# Altium schematic sheet ControllerDiagrams.SchDoc
size 1016 x 254 mm; SheetNumber: 1; SheetTotal: 1
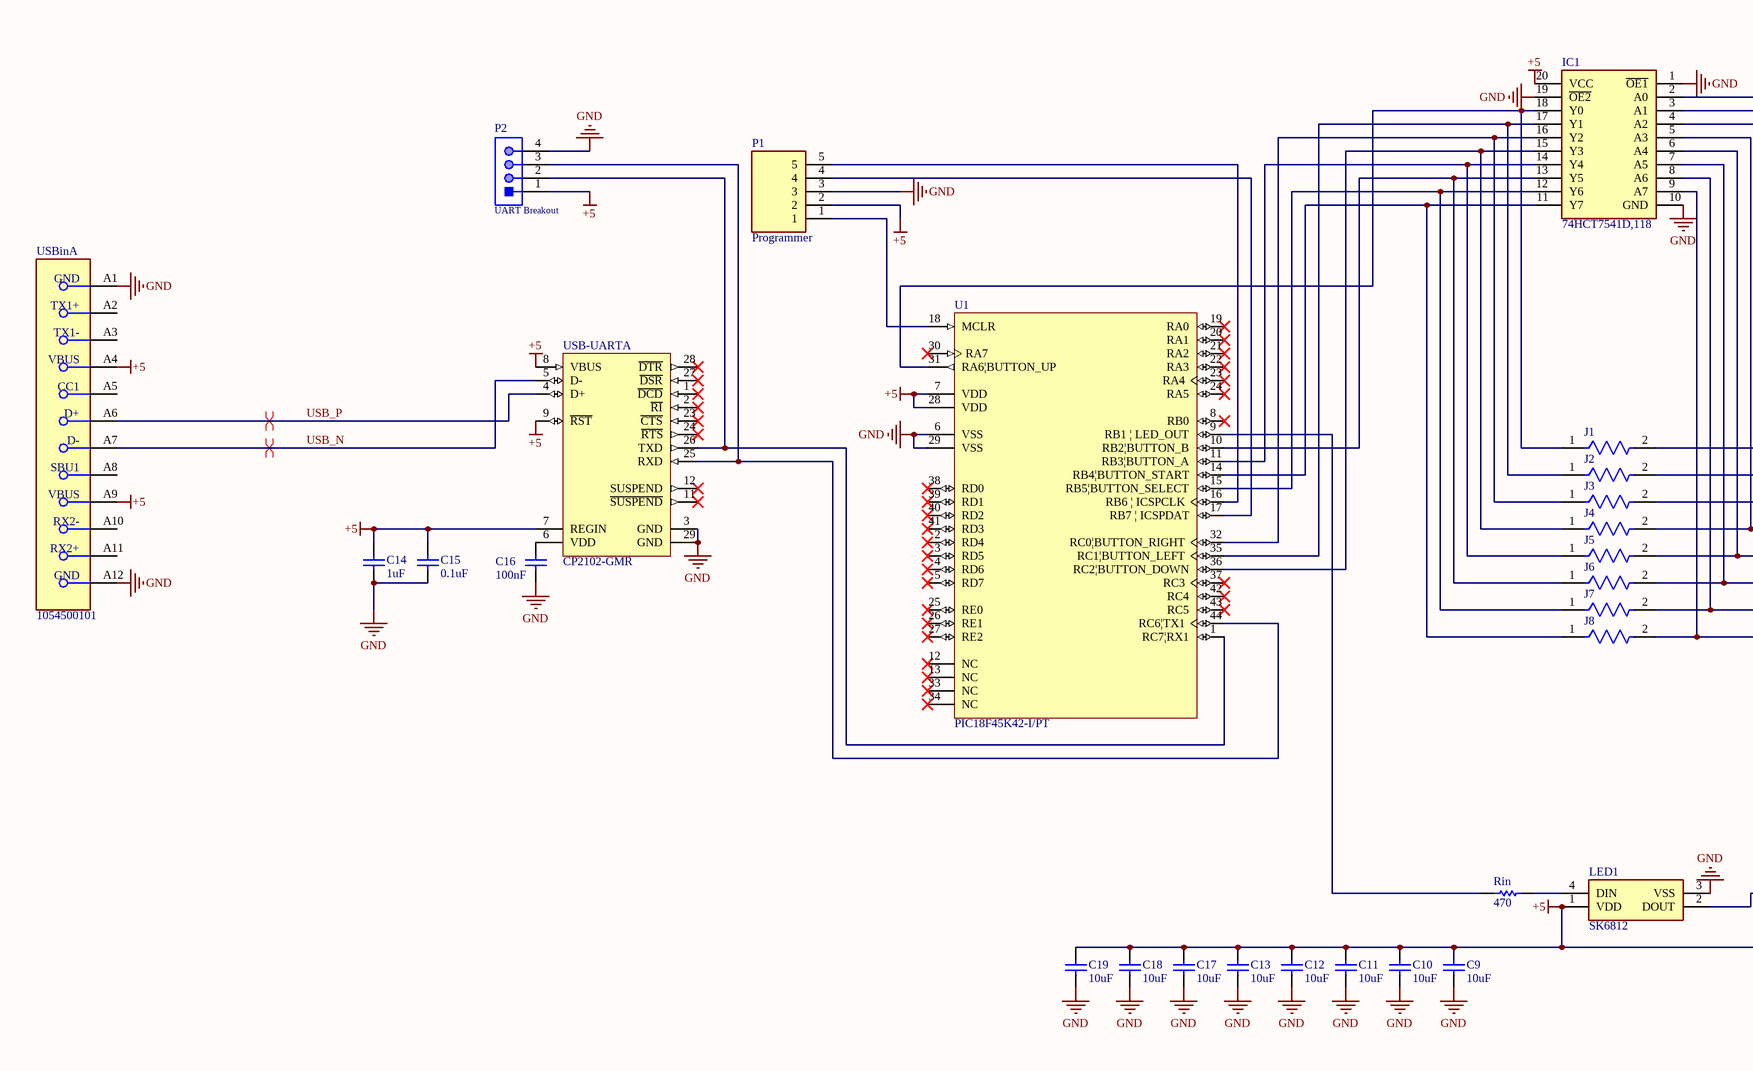
[diagram p0: ControllerDiagrams.SchDoc, left]
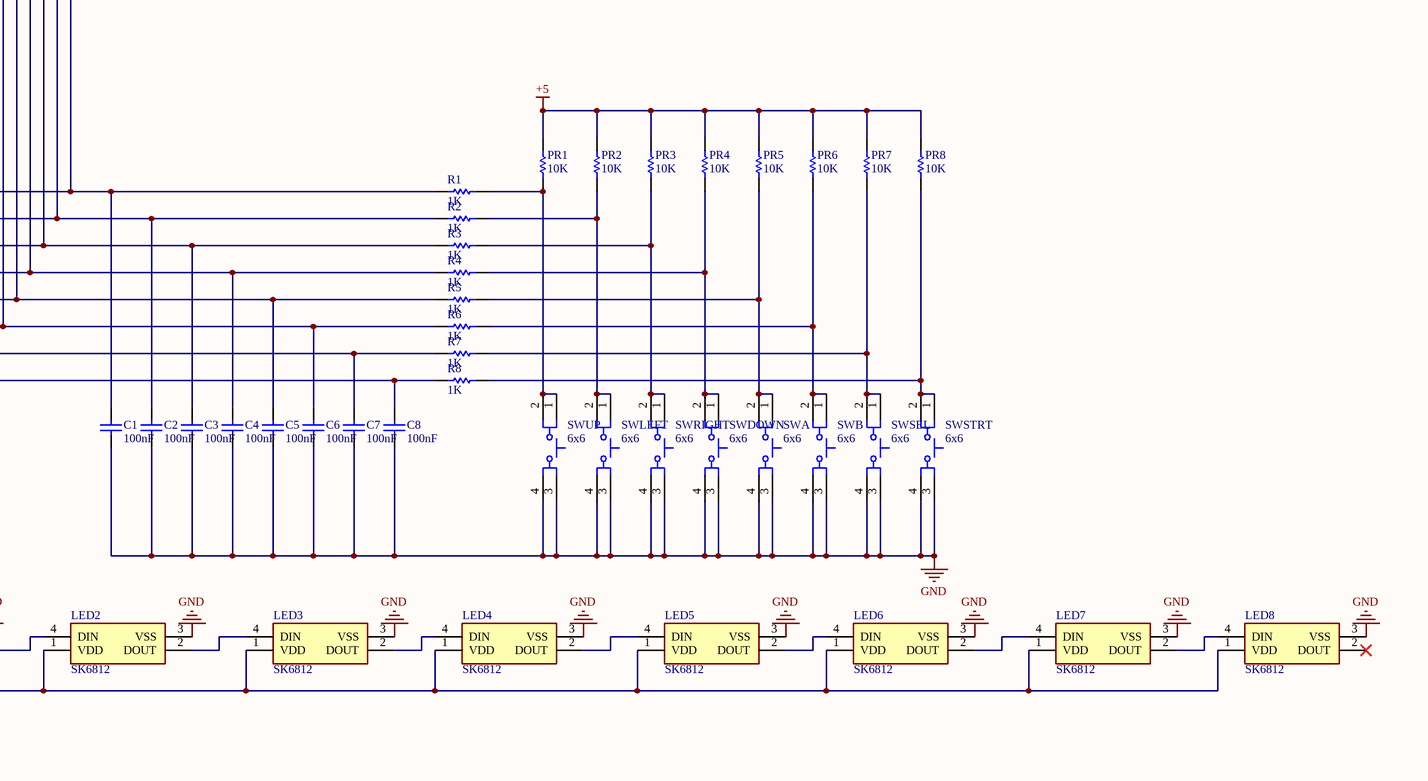
[diagram p1: ControllerDiagrams.SchDoc, right]

## Parts
C1  100nF  [CAPC2013X140X50LL20T25]
C2  100nF  [CAPC2013X140X50LL20T25]
C3  100nF  [CAPC2013X140X50LL20T25]
C4  100nF  [CAPC2013X140X50LL20T25]
C5  100nF  [CAPC2013X140X50LL20T25]
C6  100nF  [CAPC2013X140X50LL20T25]
C7  100nF  [CAPC2013X140X50LL20T25]
C8  100nF  [CAPC2013X140X50LL20T25]
C9  10uF  [CAPC2013X140X50LL20T25]
C10  10uF  [CAPC2013X140X50LL20T25]
C11  10uF  [CAPC2013X140X50LL20T25]
C12  10uF  [CAPC2013X140X50LL20T25]
C13  10uF  [CAPC2013X140X50LL20T25]
C14  1uF  [CAPC2013X140X50LL20T25]
C15  0.1uF  [CAPC2013X140X50LL20T25]
C16  100nF  [CAPC2013X140X50LL20T25]
C17  10uF  [CAPC2013X140X50LL20T25]
C18  10uF  [CAPC2013X140X50LL20T25]
C19  10uF  [CAPC2013X140X50LL20T25]
IC1  74HCT7541D,118  [SOIC127P1032X265-20N]
J1  (no value)  [FP-ERJ-3GEY0R00V-MFG]
J2  (no value)  [FP-ERJ-3GEY0R00V-MFG]
J3  (no value)  [FP-ERJ-3GEY0R00V-MFG]
J4  (no value)  [FP-ERJ-3GEY0R00V-MFG]
J5  (no value)  [FP-ERJ-3GEY0R00V-MFG]
J6  (no value)  [FP-ERJ-3GEY0R00V-MFG]
J7  (no value)  [FP-ERJ-3GEY0R00V-MFG]
J8  (no value)  [FP-ERJ-3GEY0R00V-MFG]
LED1  SK6812  [ILPHK501RGBWSK68120501]
LED2  SK6812  [ILPHK501RGBWSK68120501]
LED3  SK6812  [ILPHK501RGBWSK68120501]
LED4  SK6812  [ILPHK501RGBWSK68120501]
LED5  SK6812  [ILPHK501RGBWSK68120501]
LED6  SK6812  [ILPHK501RGBWSK68120501]
LED7  SK6812  [ILPHK501RGBWSK68120501]
LED8  SK6812  [ILPHK501RGBWSK68120501]
P1  Programmer  [HDRV5W64P0X254_1X5_1270X248X838P]
P2  UART Breakout  [61300411121]
PR1  10K  [RESC2013X50X30LL20T20]
PR2  10K  [RESC2013X50X30LL20T20]
PR3  10K  [RESC2013X50X30LL20T20]
PR4  10K  [RESC2013X50X30LL20T20]
PR5  10K  [RESC2013X50X30LL20T20]
PR6  10K  [RESC2013X50X30LL20T20]
PR7  10K  [RESC2013X50X30LL20T20]
PR8  10K  [RESC2013X50X30LL20T20]
R1  1K  [RESC2013X50X30LL20T20]
R2  1K  [RESC2013X50X30LL20T20]
R3  1K  [RESC2013X50X30LL20T20]
R4  1K  [RESC2013X50X30LL20T20]
R5  1K  [RESC2013X50X30LL20T20]
R6  1K  [RESC2013X50X30LL20T20]
R7  1K  [RESC2013X50X30LL20T20]
R8  1K  [RESC2013X50X30LL20T20]
Rin  470  [RESC2013X50X30LL20T20]
SWA  6x6  [ESWI-TL1105SPF_V]
SWB  6x6  [ESWI-TL1105SPF_V]
SWDOWN  6x6  [ESWI-TL1105SPF_V]
SWLEFT  6x6  [ESWI-TL1105SPF_V]
SWRIGHT  6x6  [ESWI-TL1105SPF_V]
SWSEL  6x6  [ESWI-TL1105SPF_V]
SWSTRT  6x6  [ESWI-TL1105SPF_V]
SWUP  6x6  [ESWI-TL1105SPF_V]
U1  PIC18F45K42-I/PT  [TQFP-PT44_M]
USB-UART  CP2102-GMR  [SLAB-QFN-28-3125x3125TP_M]  (part A of 2)
USBin  1054500101  [FP-1054500101-MFG]  (part A of 3)

## Nets
+5: C9.2 C10.2 C11.2 C12.2 C13.2 C14.2 C15.2 C17.2 C18.2 C19.2 IC1.20(VCC) LED1.1(VDD) LED2.1(VDD) LED3.1(VDD) LED4.1(VDD) LED5.1(VDD) LED6.1(VDD) LED7.1(VDD) LED8.1(VDD) P1.2 P2.1 PR1.2 PR2.2 PR3.2 PR4.2 PR5.2 PR6.2 PR7.2 PR8.2 U1.7(VDD) U1.28(VDD) USB-UART.7(REGIN) USB-UART.8(VBUS) USB-UART.9(~{RST}) USBin.A4(VBUS) USBin.A9(VBUS)
GND: C1.1 C2.1 C3.1 C4.1 C5.1 C6.1 C7.1 C8.1 C9.1 C10.1 C11.1 C12.1 C13.1 C14.1 C15.1 C16.2 C17.1 C18.1 C19.1 IC1.1(~{OE1}) IC1.10(GND) IC1.19(~{OE2}) LED1.3(VSS) LED2.3(VSS) LED3.3(VSS) LED4.3(VSS) LED5.3(VSS) LED6.3(VSS) LED7.3(VSS) LED8.3(VSS) P1.3 P2.4 SWA.3 SWA.4 SWB.3 SWB.4 SWDOWN.3 SWDOWN.4 SWLEFT.3 SWLEFT.4 SWRIGHT.3 SWRIGHT.4 SWSEL.3 SWSEL.4 SWSTRT.3 SWSTRT.4 SWUP.3 SWUP.4 U1.6(VSS) U1.29(VSS) USB-UART.3(GND) USB-UART.29(GND) USBin.A1(GND) USBin.A12(GND)
USB_N: USB-UART.5(D-) USBin.A7(D-)
USB_P: USB-UART.4(D+) USBin.A6(D+)
NetC1_2: C1.2 IC1.2(A0) J1.2 R1.2
NetC2_2: C2.2 IC1.3(A1) J2.2 R2.2
NetC3_2: C3.2 IC1.4(A2) J3.2 R3.2
NetC4_2: C4.2 IC1.5(A3) J4.2 R4.2
NetC5_2: C5.2 IC1.6(A4) J5.2 R5.2
NetC6_2: C6.2 IC1.7(A5) J6.2 R6.2
NetC7_2: C7.2 IC1.8(A6) J7.2 R7.2
NetC8_2: C8.2 IC1.9(A7) J8.2 R8.2
NetC16_1: C16.1 USB-UART.6(VDD)
NetIC1_11: IC1.11(Y7) J8.1 U1.14(RB4|BUTTON_START)
NetIC1_12: IC1.12(Y6) J7.1 U1.15(RB5|BUTTON_SELECT)
NetIC1_13: IC1.13(Y5) J6.1 U1.10(RB2|BUTTON_B)
NetIC1_14: IC1.14(Y4) J5.1 U1.11(RB3|BUTTON_A)
NetIC1_15: IC1.15(Y3) J4.1 U1.36(RC2|BUTTON_DOWN)
NetIC1_16: IC1.16(Y2) J3.1 U1.32(RC0|BUTTON_RIGHT)
NetIC1_17: IC1.17(Y1) J2.1 U1.35(RC1|BUTTON_LEFT)
NetIC1_18: IC1.18(Y0) J1.1 U1.31(RA6|BUTTON_UP)
NetLED1_2: LED1.2(DOUT) LED2.4(DIN)
NetLED1_4: LED1.4(DIN) Rin.2
NetLED2_2: LED2.2(DOUT) LED3.4(DIN)
NetLED3_2: LED3.2(DOUT) LED4.4(DIN)
NetLED4_2: LED4.2(DOUT) LED5.4(DIN)
NetLED5_2: LED5.2(DOUT) LED6.4(DIN)
NetLED6_2: LED6.2(DOUT) LED7.4(DIN)
NetLED7_2: LED7.2(DOUT) LED8.4(DIN)
NetP1_1: P1.1 U1.18(MCLR)
NetP1_4: P1.4 U1.17(RB7_|_ICSPDAT)
NetP1_5: P1.5 U1.16(RB6_|_ICSPCLK)
NetP2_2: P2.2 U1.1(RC7|RX1) USB-UART.26(TXD)
NetP2_3: P2.3 U1.44(RC6|TX1) USB-UART.25(RXD)
NetPR1_1: PR1.1 R1.1 SWUP.1 SWUP.2
NetPR2_1: PR2.1 R2.1 SWLEFT.1 SWLEFT.2
NetPR3_1: PR3.1 R3.1 SWRIGHT.1 SWRIGHT.2
NetPR4_1: PR4.1 R4.1 SWDOWN.1 SWDOWN.2
NetPR5_1: PR5.1 R5.1 SWA.1 SWA.2
NetPR6_1: PR6.1 R6.1 SWB.1 SWB.2
NetPR7_1: PR7.1 R7.1 SWSEL.1 SWSEL.2
NetPR8_1: PR8.1 R8.1 SWSTRT.1 SWSTRT.2
NetRin_1: Rin.1 U1.9(RB1_|_LED_OUT)

Not connected (* = marked no-connect by the designer): LED8 2(DOUT)*; U1 2(RD4)* 3(RD5)* 4(RD6)* 5(RD7)* 8(RB0)* 12(NC)* 13(NC)* 19(RA0)* 20(RA1)* 21(RA2)* 22(RA3)* 23(RA4)* 24(RA5)* 25(RE0)* 26(RE1)* 27(RE2)* 30(RA7)* 33(NC)* 34(NC)* 37(RC3)* 38(RD0)* 39(RD1)* 40(RD2)* 41(RD3)* 42(RC4)* 43(RC5)*; USB-UART 1(~{DCD})* 2(~{RI})* 11(~{SUSPEND})* 12(SUSPEND)* 23(~{CTS})* 24(~{RTS})* 27(~{DSR})* 28(~{DTR})*; USBin A2(TX1+) A3(TX1-) A5(CC1) A8(SBU1) A10(RX2-) A11(RX2+)

## Layout directives
differential pair: USB_N, USB_P

## Library data of the parts
C1-C19 = CMP-2000-05810-1: Chip Capacitor, 2.2 uF, +/- 10%, 10 V, -55 to 85 degC, 0805 (2012 Metric), RoHS, Tape and Reel; Manufacturer: AVX; Dielectric: X5R; Rated Voltage: 10V; Capacitance: 2.2µF; Tolerance (%): ±10%; Datasheet Version: 05/2016; Manufacturer URL: http://www.avx.com/; Package Description: 2-Pin Surface Mount Device, Body 2.01 x 1.25 mm; Mounting Technology: SurfaceMount; Case Size/Dimension: 0805; Package Reference: 0805; Datasheet URL: http://datasheets.avx.com/cx5r.pdf
IC1 = 74HCT7541D,118: Integrated Circuit; Manufacturer_Name: Nexperia; Datasheet Link: https://assets.nexperia.com/documents/data-sheet/74HC_HCT7541.pdf; Height: 2.65mm; Manufacturer_Part_Number: 74HCT7541D,118; Mouser Part Number: 771-74HCT7541D-T; Mouser Price/Stock: https://www.mouser.co.uk/ProductDetail/Nexperia/74HCT7541D118?qs=me8TqzrmIYUuRbgAkVALbQ%3D%3D; Arrow Part Number: 74HCT7541D,118; Arrow Price/Stock: https://www.arrow.com/en/products/74hct7541d118/nexperia
J1-J8 = CMP-2000-00700-2: RES SMD 0 OHM JUMPER 1/10W 0603; Manufacturer Part Number: ERJ-3GEY0R00V; Manufacturer: Panasonic; Tolerance: 5%; Automotive Grade: Grade 0; Voltage Rating: 75V; Value: 0Ω; Temperature Coefficient: -100/+600ppm/°C; Power Rating: 0.1W; Mouser Description: Resistor, Chip Thick Film, 0 Ohm, 0.1w, Resistor, Chip Thick Film, 0 Ohm, 0.1w, 5%; Ipc Land Pattern Name: RESC16080X45; Category: Res; Package: 0603; Temperature: -55°C to +155°C; Temperature Range Low: -55°C; Series: ERJ; Resistance: 0Ω; RoHS: TRUE; Composition: Thick Film; Octopart: https://octopart.com/erj-3gey0r00v-panasonic-55389238; Device Class L1: Passive Components; Footprint Url: https://industrial.panasonic.com/cdbs/www-data/pdf/RDA0000/DMA0000COL17.pdf; ComponentLink2Description: Datasheet; Device Class L2: Resistors; Temperature Range High: +155°C; Digikey Description: RES SMD 0 OHM JUMPER 1/10W 0603; Lead Free: Yes; Device Class L3: Chip SMD Resistors; Height: 0.55mm; ComponentLink2URL: https://industrial.panasonic.com/cdbs/www-data/pdf/RDA0000/AOA0000C301.pdf; Automotive: Yes
LED1-LED8 = ILPH-K501-RGBW-SK6812-05-01: LED; pin to pad: 2>4 4>2; Manufacturer_Name: Intelligent LED Solutions; Datasheet Link: http://uk.rs-online.com/web/p/products/1921700; Height: 1.7mm; Manufacturer_Part_Number: ILPH-K501-RGBW-SK6812-05-01
P1 = HTSW-105-07-L-S: Connector; Manufacturer_Name: SAMTEC; Datasheet Link: https://componentsearchengine.com/Datasheets/2/HTSW-105-07-L-S.pdf; Height: 8.38mm; Manufacturer_Part_Number: HTSW-105-07-L-S; Mouser Part Number: 200-HTSW10507LS; Mouser Price/Stock: https://www.mouser.co.uk/ProductDetail/Samtec/HTSW-105-07-L-S?qs=0lQeLiL1qybu1UQ%2Fa8lryA%3D%3D
P2 = CMP-1502-01064-1: THT Vertical Pin Header WR-PHD, Pitch 2.54 mm, Single Row, 4 pins; Manufacturer: Wurth Elektronik; Withstanding Voltage: 500VAC; Rated Current: 3A; Working Voltage: 250VAC; Pin Number: 4; Gender: Male; Contact Resistance: 20mOhm; Pitch: 2.54mm; Manufacturer URL: http://www.we-online.de; Operating Temperature: -40to105degC; Packaging: Bag; Mounting Technology: THT; Package Reference: 61300411121; Datasheet URL: https://katalog.we-online.de/em/datasheet/6130xx11121.pdf; Publisher: WurthElektronik; Part Number: 61300411121; Row Number: Single; Orientation: Vertical
PR1-PR8 R1-R8 Rin = CMP-2001-04896-1: Manufacturer: Vishay Dale; Part Number: CRCW08050000Z0EA
SWA SWB SWDOWN SWLEFT SWRIGHT SWSEL SWSTRT SWUP = CMP-2000-07248-1: Tact Switch, SPST-NO, 50 mA, 12 VDC, -20 to 70 degC, 4-Pin THD, RoHS, Bulk; Manufacturer: E-Switch; Actuation Force: 1.6N; Actuator Style: RoundButton; Package URL: http://spec_sheets.e-switch.com/specs/P010201.pdf; Contact Material: Silver; Size: 6x6mm; Manufacturer URL: http://www.e-switch.ch/en/; Datasheet Version: 12/2013; Package Description: 4-Pin Through Hole Device, Body 6 x 6 mm; Datasheet URL: https://www.e-switch.com/system/asset/product_line/data_sheet/140/TL1105.pdf; Termination Style: RightAngle; Package Reference: TL1105SPF; Mounting Technology: ThroughHole
U1 = CMP-0115-00678-1: Enhanced FLASH Microcontroller, 8K (x14-Bit words) FLASH, 368 Bytes RAM, 44-Pin TQFP, Standard VDD Range, Industrial Temperature; ComponentAvailability: Unknown. Contact manufacturer to determine status.; DatasheetVersion: revB, Oct-2003; Code_JEDEC: MS-026; PackageVersion: revBB, Aug-2009; PackageReference: TQFP-PT44; PackageDescription: 44-Lead Plastic Thin Quad Flatpack (PT) - 10x10x1mm Body, 2.00mm [TQFP]
USB-UART = CMP-2000-04924-1: Single-Chip USB to URAT Bridge, 3.3 V, -40 to 85 degC, 28-Pin QFN, RoHS, Tape and Reel; Manufacturer: Silicon Labs; Interface Circuit Standard 1: RS-232; Transmitter and Receiver FIFO Counter: No; Supply Current: 26mA; Operating Supply Voltage (Min): 3V; Operating Supply Voltage (Typ): 3.3V; Data Rate: 1000kbps; Operating Supply Voltage (Max): 3.6V; Number of Channels: 1; Package URL: http://www.silabs.com/Support%20Documents/TechnicalDocs/C8051T61x.pdf; Operating Temperature (Max): 85C; Datasheet URL: http://www.mouser.com/ds/2/368/CP2102-9-247052.pdf; Operating Temperature Classification: Industrial; Operating Temperature (Min): -40C; Package Description: 28-Pin Quad-Flat No-Leads Package, Body 5 x 5 mm, Pitch 0.5 mm; Manufacturer URL: http://www.silabs.com/; Rad Hardened: No; Package Reference: QFN-28; Pin Count: 28; Packaging: TapeandReel; Mounting: SurfaceMount; Package Type: QFNEP; Datasheet Version: Rev. 1.6, 12/2013
USBin = CMP-04767-000004-1: CONN RCP USB3.1 TYPEC 24P SMD RA; Manufacturer: Molex; Number Of Contacts: 24; Voltage Rating: 30V; Shielding: true; Is Female: yes; Current Rating: 0.25/1.25/5A; Pitch: 0.5mm; Conn Orientation: Right Angle; Package: 0; Height: 3.44mm; Footprint Url: https://www.molex.com/pdm_docs/sd/1054500101_sd.pdf; Device Class L1: Connectors; Category: Conn; Device Class L2: USB Connectors; Digikey Description: CONN RCP USB3.1 TYPEC 24P SMD RA; Contact Material: Gold,Nickel; Mouser Description: USB Shielded I/O Receptacle; Type C; Right Angle; Surface Mount; Gold over Nickel; ComponentLink2Description: Datasheet; Lead Free: Yes; Automotive: No; Temperature Range High: +85°C; RoHS: TRUE; Octopart: https://octopart.com/105450-0101-molex-68082325; ComponentLink2URL: https://www.molex.com/webdocs/datasheets/pdf/en-us/1054500101_IO_CONNECTORS.pdf; Temperature: -30°C to +85°C; Usb Standard: USB 3.1; Temperature Range Low: -30°C; Device Class L3: unset; Manufacturer Part Number: 1054500101